# Altium schematic sheet Sheet1.SchDoc
size A4
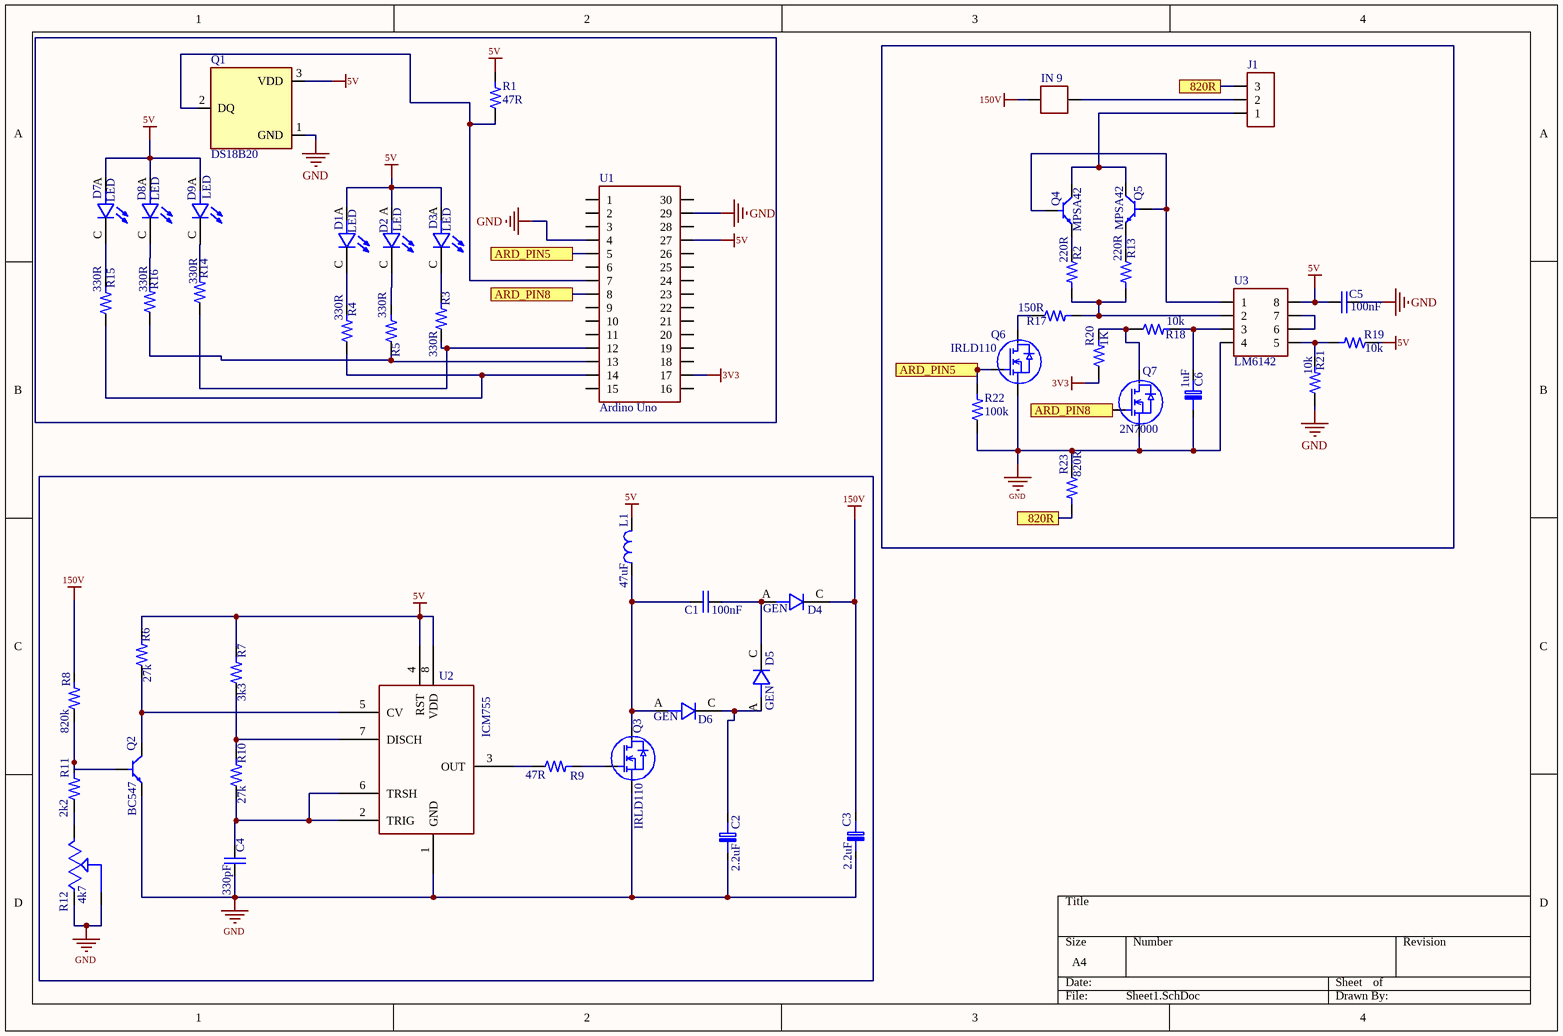
[diagram p0: Sheet1.SchDoc]

## Parts
C1  100nF  [CAP 0805]
C2  2.2uF  [CAP 1005]
C3  2.2uF  [CAP 1005]
C4  330pF  [CAP 0805]
C5  100nF  [CAP 0805]
C6  1uF  [CAP 1005]
D1  LED  [LED]
D2  LED  [LED]
D3  LED  [LED]
D4  GEN  [MUR160G]
D5  GEN  [MUR160G]
D6  GEN  [MUR160G]
D7  LED  [LED]
D8  LED  [LED]
D9  LED  [LED]
IN_9  IN_9 CONNECTOR  [IN 9]  (value not drawn)
J1  3 PIN CONNECTOR  [3 PIN CONNECTOR]  (value not drawn)
L1  47uF  [INDUCTOR 47uH]
Q1  DS18B20  [DS18B20]
Q2  BC547  [BC547]
Q3  IRLD110  [IRLD110]
Q4  MPSA42  [MPSA42]
Q5  MPSA42  [MPSA42]
Q6  IRLD110  [IRLD110]
Q7  2N7000  [2N7000]
R1  47R  [RES 1206]
R2  220R  [RES 1206]
R3  330R  [RES 1206]
R4  330R  [RES 1206]
R5  330R  [RES 1206]
R6  27k  [RES 1206]
R7  3k3  [RES 1206]
R8  820k  [RES 1206]
R9  47R  [RES 1206]
R10  27k  [RES 1206]
R11  2k2  [RES 1206]
R12  4k7  [POTENTIOMETER]
R13  220R  [RES 1206]
R14  330R  [RES 1206]
R15  330R  [RES 1206]
R16  330R  [RES 1206]
R17  150R  [RES 1206]
R18  10k  [RES 1206]
R19  10k  [RES 1206]
R20  1K  [RES 1206]
R21  10k  [RES 1206]
R22  100k  [RES 1206]
R23  820R  [RES 1206]
U1  Ardino Uno  [ARDUINO NANO]
U2  ICM755  [ICM7555]
U3  LM6142  [LM6142]

## Ports
820R, ARD_PIN5, ARD_PIN8

## Nets
3V3: R20.1 U1.17
5V: C5.1 D1.A D2.A D3.A D7.A D8.A D9.A L1.2 Q1.3(VDD) R1.2 R6.2 R7.2 R19.1 U1.27 U2.4(RST) U2.8(VDD) U3.8
150V: C3.1 D4.C IN_9.1 R8.2
GND: C2.2 C3.2 C4.1 C5.2 C6.2 Q1.1(GND) Q2.3 Q3.S Q6.S Q7.2 R12.1 R12.2 R21.1 R22.1 R23.1 U1.4 U1.29 U2.1(GND) U3.4
820R: J1.3 R23.2 ; port 820R
ARD_PIN5: Q6.G R22.2 U1.5 ; port ARD_PIN5
ARD_PIN8: Q7.1 U1.8 ; port ARD_PIN8
NetC1_1: C1.1 D6.A L1.1 Q3.D
NetC1_2: C1.2 D4.A D5.C
NetC2_1: C2.1 D5.A D6.C
NetC4_2: C4.2 R10.1 U2.2(TRIG) U2.6(TRSH)
NetC6_1: C6.1 R18.2 U3.3
NetD1_C: D1.C R4.2
NetD2_C: D2.C R5.2
NetD3_C: D3.C R3.2
NetD7_C: D7.C R15.2
NetD8_C: D8.C R16.2
NetD9_C: D9.C R14.2
NetIN_9_2: IN_9.2 J1.2
NetJ1_1: J1.1 Q4.3 Q5.3
NetQ1_2: Q1.2(DQ) R1.1 U1.7
NetQ2_1: Q2.1 R6.1 U2.5(CV)
NetQ2_2: Q2.2 R8.1 R11.2
NetQ3_G: Q3.G R9.2
NetQ4_1: Q4.1 R2.1
NetQ4_2: Q4.2 Q5.2 U3.1
NetQ5_1: Q5.1 R13.1
NetQ6_D: Q6.D R17.1
NetQ7_3: Q7.3 R18.1 R20.2
NetR2_2: R2.2 R13.2 R17.2 U3.2
NetR3_1: R3.1 R14.1 U1.12
NetR4_1: R4.1 R15.1 U1.14
NetR5_1: R5.1 R16.1 U1.13
NetR7_1: R7.1 R10.2 U2.7(DISCH)
NetR9_1: R9.1 U2.3(OUT)
NetR11_1: R11.1 R12.3
NetR19_2: R19.2 R21.2 U3.5
NetU3_6: U3.6 U3.7

Not connected (* = marked no-connect by the designer): U1 1 2 3 6 9 10 11 15 16 18 19 20 21 22 23 24 25 26 28 30

## Library data of the parts
C1 C5 = CAP 100nF
C2 C3 = CAP 2.2uF
C4 = CAP 330pF
C6 = CAP 1uF
D4-D6 = Diode
L1 = INDUCTOR 47uH
R1 R9 = RES 47R
R2 R13 = RES 220R
R3-R5 R14-R16 = RES 330
R6 R10 = RES 27K
R7 = RES 3K3
R8 = RES 820K
R11 = RES 2K2
R12 = POTENTIOMETER
R17 = RES 150R
R18 R19 R21 = RES 10K
R20 = RES 1K
R22 = RES 100K
R23 = RES 820R
U1 = ARDUINO NANO
U2 = ICM755: Supplier 1: Digi-Key; Supplier Part Number 1: ICM7555ISA+TCT-ND